# EAGLE design rpi2_brkout (EAGLE 7.7.0)
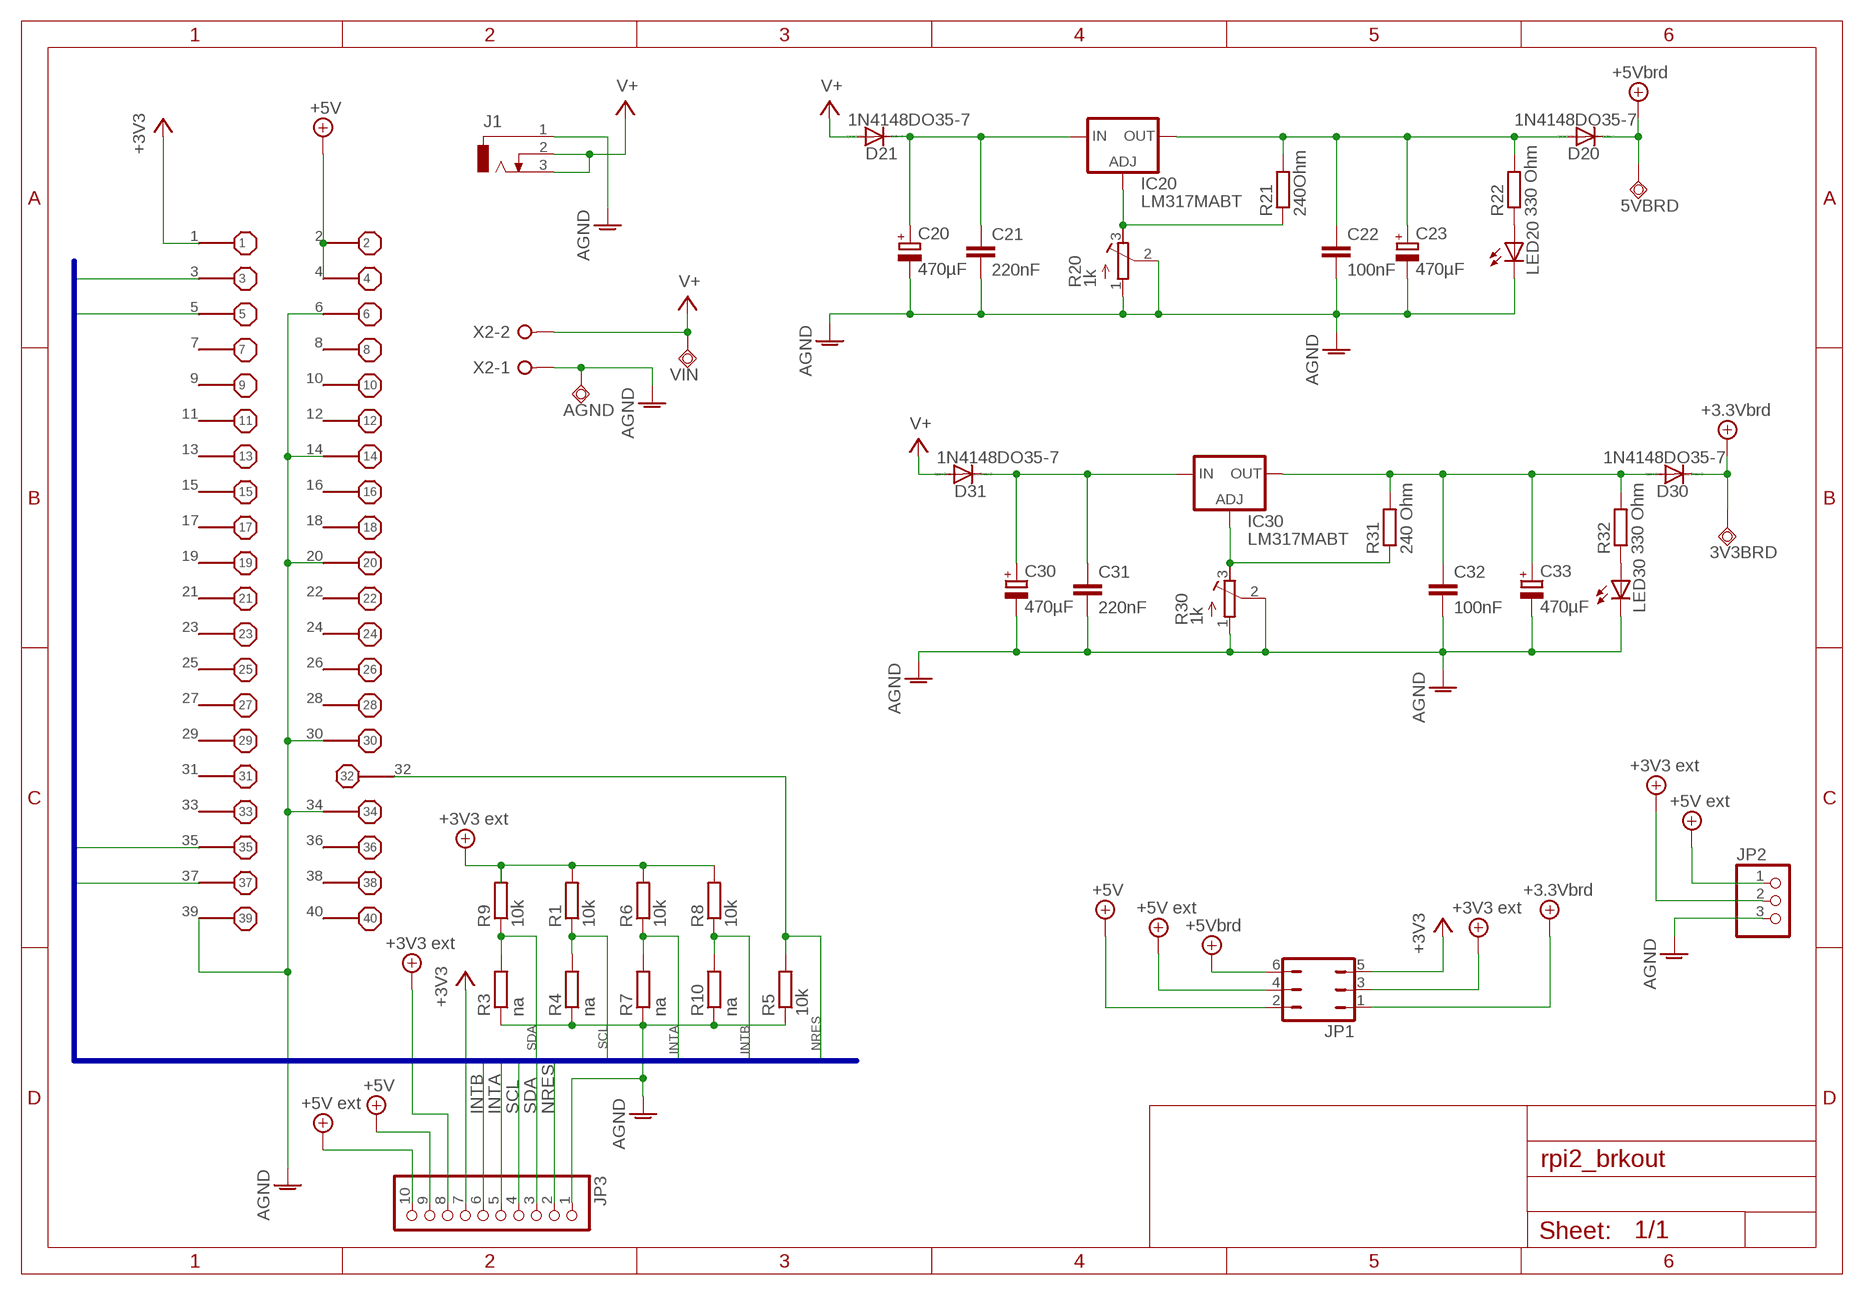
[diagram p0: schematic, sheet 1]

## Parts
3V3BRD  TPSQTP20SQ  [TP20SQ]
5VBRD  TPSQTP20SQ  [TP20SQ]
AGND  TPSQTP20SQ  [TP20SQ]
C20  470µF  CPOL-EUE5-10.5  [E5-10,5]
C21  220nF  C-EU050-030X075  [C050-030X075]
C22  100nF  C-EU025-025X050  [C025-025X050]
C23  470µF  CPOL-EUE5-10.5  [E5-10,5]
C30  470µF  CPOL-EUE5-10.5  [E5-10,5]
C31  220nF  C-EU050-030X075  [C050-030X075]
C32  100nF  C-EU025-025X050  [C025-025X050]
C33  470µF  CPOL-EUE5-10.5  [E5-10,5]
D20  1N4148DO35-7  [DO35-7]
D21  1N4148DO35-7  [DO35-7]
D30  1N4148DO35-7  [DO35-7]
D31  1N4148DO35-7  [DO35-7]
IC20  LM317MABT  [TO220L1]
IC30  LM317MABT  [TO220L1]
J1  DCJ0303  [DCJ0303]
JP1  JP3Q  [JP3Q]
JP2  PINHD-1X3  [1X03]
JP3  PINHD-1X10  [1X10]
LED20  LED5MM  [LED5MM]
LED30  LED5MM  [LED5MM]
R1  10k  R-EU_R0805  [R0805]
R3  na  R-EU_R0805  [R0805]
R4  na  R-EU_R0805  [R0805]
R5  10k  R-EU_R0805  [R0805]
R6  10k  R-EU_R0805  [R0805]
R7  na  R-EU_R0805  [R0805]
R8  10k  R-EU_R0805  [R0805]
R9  10k  R-EU_R0805  [R0805]
R10  na  R-EU_R0805  [R0805]
R20  1k  R-TRIMM64W  [RTRIM64W]
R21  240Ohm  R-EU_0207/10  [0207/10]
R22  330 Ohm  R-EU_0207/10  [0207/10]
R30  1k  R-TRIMM64W  [RTRIM64W]
R31  240 Ohm  R-EU_0207/10  [0207/10]
R32  330 Ohm  R-EU_0207/10  [0207/10]
VIN  TPSQTP20SQ  [TP20SQ]
X1  B+_GPIO  [B+_GPIO]
X2  W237-02P  [W237-132]

## Nets
3.3VEXT: R1.2 R6.2 R8.2 R9.2 ; supply symbol labelled +3V3 ext
+3V3: JP1.5 JP3.7 X1.1
+5V: JP1.2 JP3.9 X1.2 X1.4
+5V/1: JP1.4 JP2.1 JP3.10 ; supply symbol labelled +5V ext
+5V/2: JP1.3 JP2.2 JP3.8 ; supply symbol labelled +3V3 ext
+5V/3: 3V3BRD.TP D30.C JP1.1 ; supply symbol labelled +3.3Vbrd
+5V/4: 5VBRD.TP D20.C JP1.6 ; supply symbol labelled +5Vbrd
AGND: AGND.TP C20.- C21.2 C22.2 C23.- C30.- C31.2 C32.2 C33.- J1.1 JP2.3 JP3.1 LED20.K(C) LED30.K(C) R3.1 R4.1 R5.1 R7.1 R10.1 R20.1(A) R20.2(S) R30.1(A) R30.2(S) X1.6 X1.14 X1.20 X1.30 X1.34 X1.39 X2.1
INTA: JP3.5 R6.1 R7.2 X1.37
INTB: JP3.6 R8.1 R10.2 X1.35
N$1: IC30.1(ADJ) R30.3(E) R31.1
N$2: IC20.1(ADJ) R20.3(E) R21.1
N$3: C22.1 C23.+ D20.A IC20.2(OUT) R21.2 R22.2
N$4: LED20.A R22.1
N$5: C32.1 C33.+ D30.A IC30.2(OUT) R31.2 R32.2
N$6: LED30.A R32.1
N$7: C20.+ C21.1 D21.C IC20.3(IN)
N$8: C30.+ C31.1 D31.C IC30.3(IN)
NRES: JP3.2 R5.2 X1.32
SCL: JP3.4 R1.1 R4.2 X1.5
SDA: JP3.3 R3.2 R9.1 X1.3
V+: D21.A D31.A J1.2 J1.3 VIN.TP X2.2
Unconnected: X1.7 X1.8 X1.9 X1.10 X1.11 X1.12 X1.13 X1.15 X1.16 X1.17 X1.18 X1.19 X1.21 X1.22 X1.23 X1.24 X1.25 X1.26 X1.27 X1.28 X1.29 X1.31 X1.33 X1.36 X1.38 X1.40

## Buses
INTA,INTB,SCL,SDA,NRES

## Library data of the parts
3V3BRD 5VBRD AGND VIN = testpad:TPSQ: Test pad
C20 C23 C30 C33 = rcl:CPOL-EU: POLARIZED CAPACITOR, European symbol
C21 C22 C31 C32 = rcl:C-EU: CAPACITOR, European symbol
D20 D21 D30 D31 = diode:1N4148: DIODE high speed (Philips)
IC20 IC30 = v-reg:LM317?*: 500 mA Adjustable Output Positive Voltage Regulator Source: http://www.onsemi.co.jp .. LM317M-D.PDF
J1 = con-jack:DCJ0303: DC POWER JACK Source: DCJ0303.pdf; OC_FARNELL: unknown; OC_NEWARK: unknown
JP1 = jumper:JP3Q: JUMPER
JP2 = pinhead:PINHD-1X3: PIN HEADER
JP3 = pinhead:PINHD-1X10: PIN HEADER
LED20 LED30 = led:LED: LED OSRAM: - CHIPLED LG R971, LG N971, LY N971, LG Q971, LY Q971, LO R971, LY R971 LH N974, LH R974 LS Q976, LO Q976, LY Q976 LO Q996 - Hyper CHIPLED LW Q18S LB Q993, LB Q99A, LB R99A - SideLED LS A670, LO A670, LY A670, LG A670, LP A670 LB A673, LV A673, LT A673, LW A673 LH A674 LY A675 LS A676, LA A676, LO A676, LY A676, LW A676 LS A679, LY A679, LG A679 - Hyper Micro SIDELED® LS Y876, LA Y876, LO Y876, LY Y876 LT Y87S - SmartLED LW L88C, LW L88S LB L89C, LB L89S, LG L890 LS L89K, LO L89K, LY L89K LS L896, LA L896, LO L896, LY L896 - TOPLED LS T670, LO T670, LY T670, LG T670, LP T670 LSG T670, LSP T670, LSY T670, LOP T670, LYG T670 LG T671, LOG T671, LSG T671 LB T673, LV T673, LT T673, LW T673 LH T674 LS T676, LA T676, LO T676, LY T676, LB T676, LH T676, LSB T676, LW T676 LB T67C, LV T67C, LT T67C, LS T67K, LO T67K, LY T67K, LW E67C LS E67B, LA E67B, LO E67B, LY E67B, LB E67C, LV E67C, LT E67C LW T67C LS T679, LY T679, LG T679 LS T770, LO T770, LY T770, LG T770, LP T770 LB T773, LV T773, LT T773, LW T773 LH T774 LS E675, LA E675, LY E675, LS T675 LS T776, LA T776, LO T776, LY T776, LB T776 LHGB T686 LT T68C, LB T68C - Hyper Mini TOPLED® LB M676 - Mini TOPLED Santana® LG M470 LS M47K, LO M47K, LY M47K Source: http://www.osram.convergy.de LUXEON: - LUMILED® LXK2-PW12-R00, LXK2-PW12-S00, LXK2-PW14-U00, LXK2-PW14-V00 LXK2-PM12-R00, LXK2-PM12-S00, LXK2-PM14-U00 LXK2-PE12-Q00, LXK2-PE12-R00, LXK2-PE12-S00, LXK2-PE14-T00, LXK2-PE14-U00 LXK2-PB12-K00, LXK2-PB12-L00, LXK2-PB12-M00, LXK2-PB14-N00, LXK2-PB14-P00, LXK2-PB14-Q00 LXK2-PR12-L00, LXK2-PR12-M00, LXK2-PR14-Q00, LXK2-PR14-R00 LXK2-PD12-Q00, LXK2-PD12-R00, LXK2-PD12-S00 LXK2-PH12-R00, LXK2-PH12-S00 LXK2-PL12-P00, LXK2-PL12-Q00, LXK2-PL12-R00 Source: www.luxeon.com KINGBRIGHT: KA-3528ASYC Source: www.kingbright.com
R1 R3-R10 R21 R22 R31 R32 = rcl:R-EU_: RESISTOR, European symbol
R20 R30 = rcl:R-TRIMM: Trimm resistor
X1 = raspberry:B+_GPIO
X2 = con-wago-508:W237-02P: WAGO SREW CLAMP; OC_FARNELL: unknown; OC_NEWARK: unknown

## Board
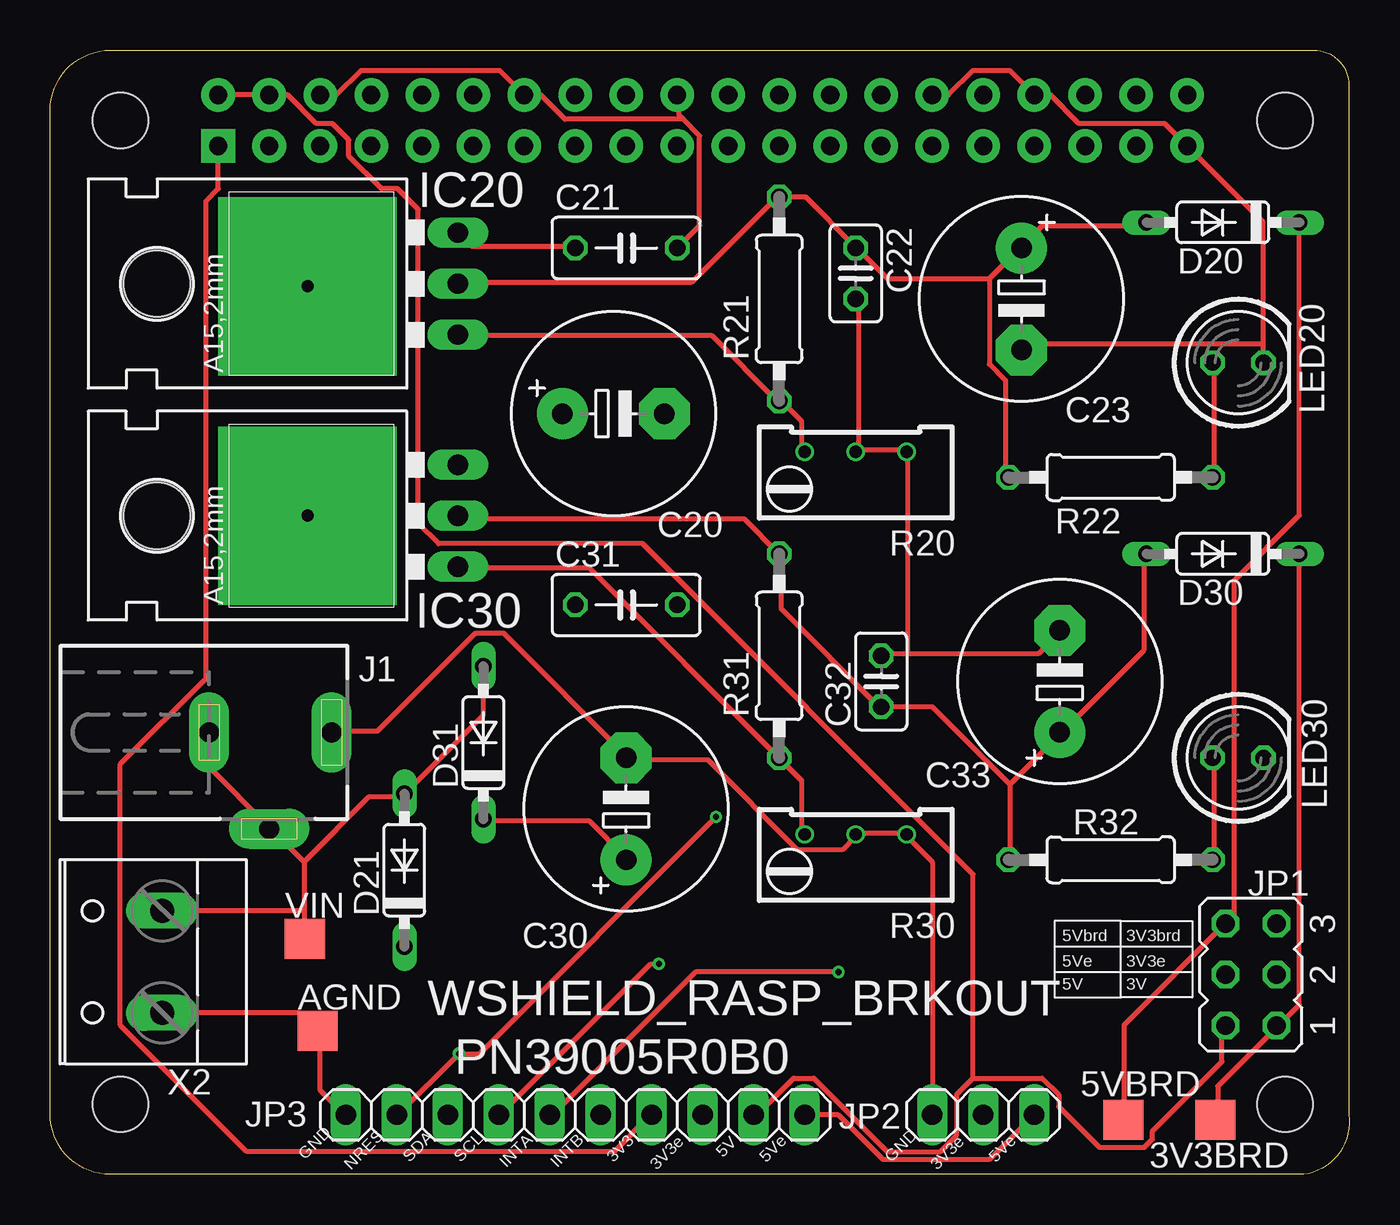
[diagram p1: board, top side]
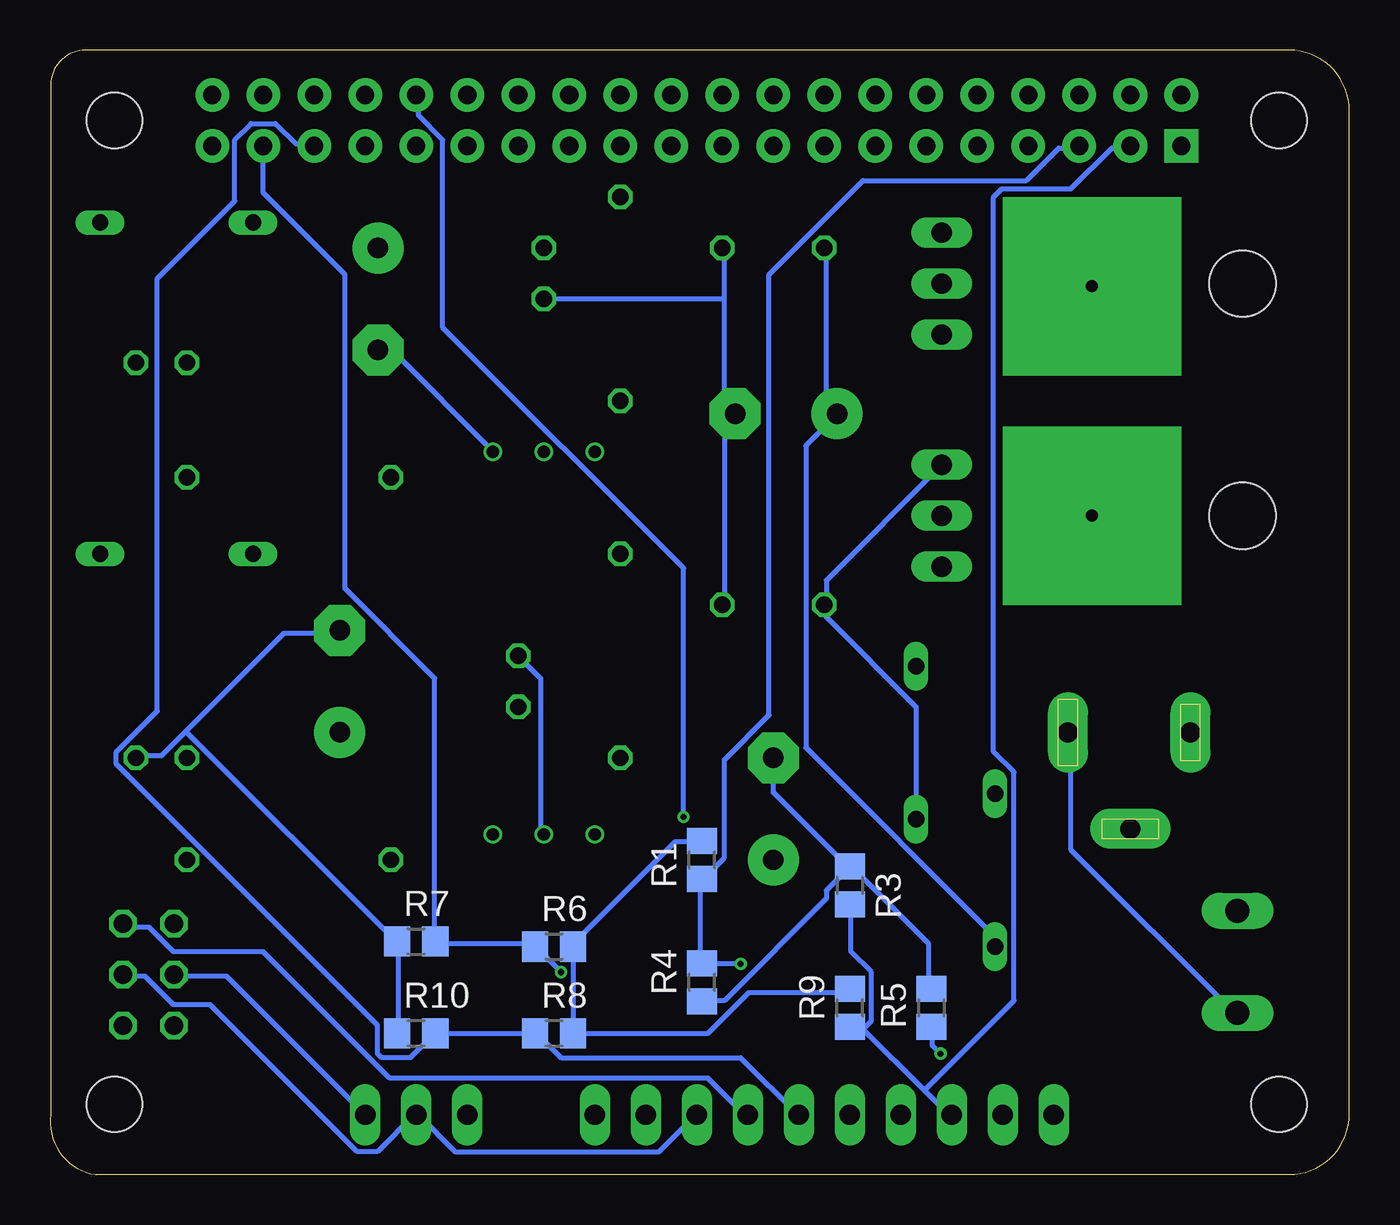
[diagram p2: board, bottom side, seen from below]

Size 64.71 x 56 mm. Coordinates in mm from the lower left corner, seen from the top.
Outline: 0,53 arc-90 3,56 62.95,56 arc-90 64.68,54.27 64.68,3 arc-90 62.44,0 3,0 arc-90 0,3 0,53
Copper layers (1*16): Top 0.035mm / dielectric 1.6mm / Bottom 0.035mm
Design rules "Elecrow_2-layer_PCB_eagle_rule *": minimum track width 10mil, minimum drill 12mil, track to track 6mil, track to pad 6mil, pad to pad 6mil, via to via 8mil, smd to smd 0mil, copper to edge 20mil, drill to drill 10mil, minimum pad ring 6mil, minimum via ring 6mil, stop-mask expansion 0mil, vias tented up to drill 100mil, thermal gap 10mil
Holes 2.75 mm at 3.5,52.5 3.5,3.5 61.5,52.5 61.5,3.5

### Footprints (pad centres in the part's own frame; a part is rotated, then mirrored left to right if it is on the bottom)
TP20SQ = smd 2 x 2: TP 0,0
E5-10,5 = drill 1.016 pad 2.54: + -2.54,0 | drill 1.016 pad 2.54 octagon: - 2.54,0
C050-030X075 = drill 0.813 octagon: 1 -2.54,0; 2 2.54,0
C025-025X050 = drill 0.813 octagon: 1 -1.27,0; 2 1.27,0
DO35-7 = drill 0.813 long: A 3.81,0; C -3.81,0
TO220L1 = drill 1.016 long: 1 -2.54,-3.81; 2 0,-3.81; 3 2.54,-3.81 | hole 3.302: 0,11.176
DCJ0303 = drill 1 pad 2 long: 1 0,3.1; 2 4.8,0; 3 0,-3
JP3Q = drill 0.914 octagon: 1 -2.54,-1.27; 2 -2.54,1.27; 3 0,-1.27; 4 0,1.27; 5 2.54,-1.27; 6 2.54,1.27
1X03 = drill 1.016 long: 1 -2.54,0; 2 0,0; 3 2.54,0
1X10 = drill 1.016 long: 1 -11.43,0; 2 -8.89,0; 3 -6.35,0; 4 -3.81,0; 5 -1.27,0; 6 1.27,0; 7 3.81,0; 8 6.35,0; 9 8.89,0; 10 11.43,0
LED5MM = drill 0.813 octagon: A -1.27,0; K 1.27,0
R0805 = smd 1.3 x 1.5: 1 -0.95,0; 2 0.95,0
RTRIM64W = drill 0.61: 1 1.27,-2.54; 2 1.27,0; 3 1.27,2.54
0207/10 = drill 0.813 octagon: 1 -5.08,0; 2 5.08,0
B+_GPIO = drill 0.9 pad 1.676 square: 1 -24.13,-1.27 | drill 0.9 pad 1.676: 2 -24.13,1.27; 3 -21.59,-1.27; 4 -21.59,1.27; 5 -19.05,-1.27; 6 -19.05,1.27; 7 -16.51,-1.27; 8 -16.51,1.27; 9 -13.97,-1.27; 10 -13.97,1.27; 11 -11.43,-1.27; 12 -11.43,1.27; 13 -8.89,-1.27; 14 -8.89,1.27; 15 -6.35,-1.27; 16 -6.35,1.27; 17 -3.81,-1.27; 18 -3.81,1.27; 19 -1.27,-1.27; 20 -1.27,1.27; 21 1.27,-1.27; 22 1.27,1.27; 23 3.81,-1.27; 24 3.81,1.27; 25 6.35,-1.27; 26 6.35,1.27; 27 8.89,-1.27; 28 8.89,1.27; 29 11.43,-1.27; 30 11.43,1.27; 31 13.97,-1.27; 32 13.97,1.27; 33 16.51,-1.27; 34 16.51,1.27; 35 19.05,-1.27; 36 19.05,1.27; 37 21.59,-1.27; 38 21.59,1.27; 39 24.13,-1.27; 40 24.13,1.27
W237-132 = drill 1.194 long: 1 -2.54,-0.635; 2 2.54,-0.635

### Placement (x,y rotation side)
3V3BRD  58.03,2.72 0 top
5VBRD  53.45,2.72 0 top
AGND  13.32,7.16 0 top
C20  28.05,37.9 0 top
C21  28.69,46.15 0 top
C22  40.12,44.88 270 top
C23  48.38,43.61 270 top
C30  28.69,18.21 90 top
C31  28.69,28.37 0 top
C32  41.39,24.56 90 top
C33  50.28,24.56 90 top
D20  58.41,47.42 180 top
D21  17.64,15.16 90 top
D30  58.41,30.91 180 top
D31  21.58,21.51 90 top
IC20  16.5,44.37 90 top
IC30  16.5,32.81 90 top
J1  10.91,22.02 270 top
JP1  59.8,9.96 90 top
JP2  46.47,2.97 180 top
JP3  26.15,2.97 0 top
LED20  59.17,40.44 0 top
LED30  59.17,20.75 0 top
R1  32.25,15.67 90 bottom
R3  24.88,14.4 270 bottom
R4  32.25,9.57 90 bottom
R5  20.82,8.3 270 bottom
R6  39.61,11.35 0 bottom
R7  46.47,11.61 0 bottom
R8  39.61,7.03 0 bottom
R9  24.88,8.3 90 bottom
R10  46.47,7.03 0 bottom
R20  40.12,34.72 90 top
R21  36.31,43.61 90 top
R22  52.82,34.72 180 top
R30  40.12,15.67 90 top
R31  36.31,25.83 90 top
R32  52.82,15.67 180 top
VIN  12.69,11.73 0 top
X1  32.5,52.5 0 top
X2  4.94,10.59 90 top

### Tracks (layer width: path | path; a pad name or v marks a point on that pad's centre or on a via)
3.3VEXT
  Bottom 0.254: 38.65,7.03 31.94,7.03 29.91,9.07 25.03,9.07 R9.2 | 38.65,7.03 38.65,11.3 R6.2 38.65,11.5 33.57,16.58 32.35,16.58 R1.2 | 38.65,7.03 R8.2
+3V3
  Top 0.254: X1.1 8.37,49.1 7.76,48.49 7.76,24.71 3.49,20.45 3.49,7.44 9.79,1.14 28.08,1.14 29.91,2.97 JP3.7
  Bottom 0.254: JP1.5 61,12.32 59.78,12.32 58.56,11.1 54.09,11.1 47.79,4.8 31.94,4.8 30.11,2.97 JP3.7
+5V
  Top 0.254: X1.2 X1.4 11.82,53.77 13.25,52.35 14.06,52.35 14.87,51.54 14.87,50.72 16.5,49.1 17.31,49.1 18.33,48.08 18.33,32.43 19.34,31.42 29.5,31.42 45.96,14.96 45.96,4.8 | 45.96,4.8 49.42,4.8 50.23,3.99 50.23,3.38 52.26,1.34 54.5,1.34 54.9,1.75 54.9,2.16 58.36,5.61 58.36,7.24 JP1.2 | 45.96,4.8 45.15,3.99 45.15,1.95 44.34,1.14 41.7,1.14 38.04,4.8 37.02,4.8 35.19,2.97 JP3.9
+5V/1
  Top 0.254: JP3.10 39.26,2.97 41.49,0.74 46.77,0.74 JP2.1
  Bottom 0.254: JP2.1 55.92,9.88 58.36,9.88 JP1.4
+5V/2
  Bottom 0.254: JP1.3 61,9.88 59.98,9.88 58.56,8.46 56.73,8.46 49.42,1.14 48.4,1.14 46.57,2.97 JP2.2 46.37,2.97 44.54,1.14 34.38,1.14 32.55,2.97 JP3.8
+5V/3
  Top 0.254: 3V3BRD.TP 58.15,2.77 58.15,4.39 61,7.24 JP1.1 61.2,7.44 62.22,8.46 D30.C
+5V/4
  Top 0.254: 5VBRD.TP 53.48,2.77 53.48,7.44 JP1.6 58.97,12.93 58.97,29.59 62.22,32.84 D20.C
AGND
  Top 0.254: X1.30 44.74,53.77 45.96,54.99 47.79,54.99 X1.34 49.82,53.77 51.24,52.35 55.51,52.35 X1.39 60.39,47.47 60.39,41.38 | 60.39,41.38 60.39,40.56 LED20.K | 40.27,36.09 42.51,36.09 R20.1 42.71,35.89 42.71,25.93 | 40.27,36.09 40.27,43.61 C22.2 | 40.27,36.09 R20.2 | X1.6 14.26,53.77 15.48,54.99 22.39,54.99 X1.14 24.42,53.77 25.64,52.55 31.54,52.55 | 31.54,52.55 32.35,51.74 32.35,47.27 C21.2 | 31.54,52.55 31.33,52.75 31.33,53.77 X1.20 | 60.39,41.38 48.6,41.38 48.4,41.17 C23.- | JP3.1 14.67,2.97 13.45,4.19 13.45,7.03 AGND.TP 12.43,8.05 X2.1 | 42.71,25.93 49.21,25.93 50.23,26.95 C33.- | 42.71,25.93 41.49,25.93 C32.2 | JP2.3 43.93,15.57 42.71,16.79 R30.1 42.51,16.99 40.27,16.99 R30.2 40.07,16.79 39.46,16.18 37.22,16.18 32.75,20.65 28.69,20.65 C30.- 28.69,20.85 22.59,26.95 21.17,26.95 16.3,22.07 14.06,22.07 J1.1
  Bottom 0.254: C23.- 48.2,40.97 47.59,40.97 42.71,36.09 R20.1 | C31.2 31.13,28.37 31.13,37.31 30.72,37.72 C20.- 30.72,37.92 31.13,38.33 31.13,43.61 | 31.13,43.61 31.13,46.05 C21.2 | 31.13,43.61 C22.2 | J1.1 13.86,21.87 13.86,16.18 5.73,8.05 X2.1 | R5.1 20.97,9.27 20.97,11.5 24.83,15.37 R3.1 | R4.1 32.14,8.66 31.13,8.66 26.05,13.74 26.05,14.15 25.03,15.16 R3.1 | C30.- 28.69,19.02 25.03,15.37 R3.1 | R10.1 47.38,7.03 47.38,11.5 R7.1 47.59,11.71 57.95,22.07 | 57.95,22.07 53.07,26.95 50.43,26.95 C33.- | 57.95,22.07 59.17,20.85 60.39,20.85 LED30.K | C32.2 40.27,24.71 40.27,16.99 R30.2
HEAT1  (via drill 0.6 pad 8.89)
  other vias: 12.82,44.24
HEAT2  (via drill 0.6 pad 8.89)
  other vias: 12.82,32.81
INTA  (via drill 0.3)
  Top 0.254: v39.26,10.08 32.14,10.08 25.03,2.97 JP3.5
  Bottom 0.254: v39.26,10.08 40.48,11.3 R6.1 40.68,11.5 45.35,11.5 R7.2 45.56,11.71 45.56,24.71 50.03,29.18 50.03,44.83 54.09,48.89 X1.37
INTB
  Bottom 0.254: JP3.6 27.47,2.97 30.32,5.81 39.26,5.81 40.48,7.03 R8.1 R10.2 45.56,7.03 46.77,5.81 48.2,5.81 48.4,6.02 48.4,7.44 61.41,20.45 61.41,21.05 59.37,23.09 59.37,44.63 55.51,48.49 55.51,51.54 54.7,52.35 53.48,52.35 52.46,51.33 51.65,51.33 X1.35
N$1
  Top 0.254: R30.3 37.43,16.99 37.43,19.63 R31.1 26.86,30.2 20.36,30.2 IC30.1
N$2
  Top 0.254: R20.3 37.43,36.09 37.43,37.51 36.41,38.53 R21.1 36.21,38.53 32.96,41.78 20.36,41.78 IC20.1
N$3
  Top 0.254: 46.77,44.63 46.77,40.36 47.59,39.55 47.59,34.87 R22.2 | 46.77,44.63 48.2,46.05 C23.+ 48.4,46.25 49.42,47.27 54.5,47.27 D20.A | IC20.2 20.36,44.42 31.94,44.42 36.21,48.69 R21.2 37.63,48.69 40.07,46.25 C22.1 40.27,46.05 41.7,44.63 46.77,44.63
N$4
  Top 0.254: R22.1 57.95,34.87 57.95,40.36 LED20.A
N$5
  Top 0.254: 47.79,19.43 47.79,15.77 R32.2 | 47.79,19.43 50.23,21.87 C33.+ 50.43,22.07 54.5,26.14 54.5,30.81 D30.A | 47.79,19.43 43.93,23.29 C32.1 41.29,23.29 36.41,28.17 36.41,30.81 R31.2 34.58,32.64 20.36,32.64 IC30.2
N$6
  Top 0.254: R32.1 57.95,15.77 57.95,20.65 LED30.A
N$7
  Top 0.254: IC20.3 20.97,46.25 26.05,46.25 C21.1
  Bottom 0.254: D21.C 17.72,11.5 17.72,11.91 27.06,21.26 27.06,36.3 25.64,37.72 C20.+ 25.64,37.92 26.05,38.33 26.05,46.05 C21.1
N$8
  Top 0.254: D31.C 21.58,17.6 26.86,17.6 28.69,15.77 C30.+
  Bottom 0.254: 26.05,28.37 26.05,29.59 20.36,35.28 IC30.3 | D31.C 21.58,23.29 26.05,27.76 26.05,28.37 | 26.05,28.37 C31.1
NRES  (via drill 0.3)
  Top 0.254: JP3.2 17.31,2.97 v20.36,6.02 21.38,6.02 v33.16,17.8
  Bottom 0.254: v20.36,6.02 20.77,6.42 20.77,7.24 R5.2 | v33.16,17.8 33.16,30.2 45.15,42.19 45.15,51.54 46.37,52.75 46.37,53.77 X1.32
SCL  (via drill 0.3)
  Top 0.254: v30.32,10.49 29.91,10.49 22.39,2.97 JP3.4
  Bottom 0.254: v30.32,10.49 32.14,10.49 R4.2 32.35,10.69 32.35,14.55 R1.1 32.14,14.76 31.13,15.77 31.13,20.65 28.89,22.88 28.89,44.83 24.22,49.5 16.09,49.5 14.47,51.13 13.45,51.13 X1.5
SDA
  Bottom 0.254: 24.22,7.24 24.83,7.24 R9.1 24.22,7.24 | 21.17,4.19 19.95,2.97 JP3.3 | 21.17,4.19 24.22,7.24 | 24.22,7.24 23.81,7.64 23.81,10.08 24.83,11.1 24.83,13.33 R3.2 | 21.17,4.19 16.7,8.66 16.7,20.04 17.72,21.05 17.72,48.69 17.31,49.1 13.86,49.1 11.82,51.13 11.01,51.13 X1.3
V+
  Top 0.254: 12.64,15.57 12.64,13.13 | 12.64,13.13 12.64,11.91 VIN.TP | 12.64,15.57 11.01,17.19 J1.2 10.81,17.4 7.96,20.24 7.96,21.87 J1.3 | 12.64,15.57 15.89,18.82 17.51,18.82 D21.A 17.72,19.02 21.58,22.88 D31.A | 12.64,13.13 X2.2

### Text on the board
tNames: 5Vbrd | 3V3brd | 5Ve | 3V3e | 5V | 3V | WSHIELD_RASP_BRKOUT | PN39005R0B0 | GND | SDA | SCL | 3V3 | 5V | 5Ve | GND | 5Ve | NRES | INTA | INTB | 3V3e | 3V3e